# Altium schematic sheet RoboRIOSPIBreakout.SchDoc
size A; SheetNumber: 1; SheetTotal: 1
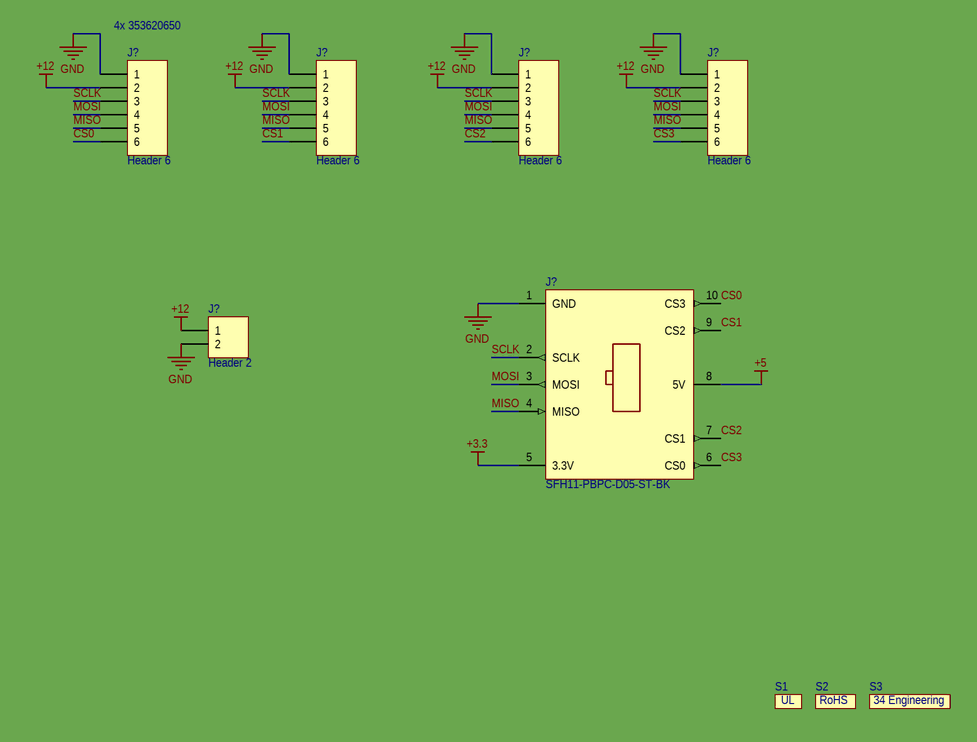
[diagram p0: RoboRIOSPIBreakout.SchDoc]

## Parts
(Parts that share a designator on the sheet are numbered #1, #2 ... from top to bottom, then left to right.)
J?#1  Header 6  [HDR1X6]
J?#2  Header 6  [HDR1X6]
J?#3  Header 6  [HDR1X6]
J?#4  Header 6  [HDR1X6]
J?#5  SFH11-PBPC-D05-ST-BK  [SFH11-PBPC-D05-ST-BK]
J?#6  Header 2  [HDR1X2]
S1  (no value)  [UL]
S2  (no value)  [RoHS]
S3  (no value)  [34EngineeringLogo]

## Nets
+3.3: J?#5.5(3.3V)
+5: J?#5.8(5V)
+12: J?#1.2 J?#2.2 J?#3.2 J?#4.2 J?#6.1
GND: J?#1.1 J?#2.1 J?#3.1 J?#4.1 J?#5.1(GND) J?#6.2
CS0: J?#1.6 J?#5.10(CS3)
CS1: J?#2.6 J?#5.9(CS2)
CS2: J?#3.6 J?#5.7(CS1)
CS3: J?#4.6 J?#5.6(CS0)
MISO: J?#1.5 J?#2.5 J?#3.5 J?#4.5 J?#5.4(MISO)
MOSI: J?#1.4 J?#2.4 J?#3.4 J?#4.4 J?#5.3(MOSI)
SCLK: J?#1.3 J?#2.3 J?#3.3 J?#4.3 J?#5.2(SCLK)

## Notes on the sheet
- (near J?#1) 4x 353620650
- (in symbol 34EngineeringLogo) 34 Engineering

## Library data of the parts
J?#1-J?#4 = Header 6: Header, 6-Pin; LatestRevisionDate: 17-Jul-2002; LatestRevisionNote: Re-released for DXP Platform.; Publisher: Altium Limited
J?#5 = SFH11-PBPC-D05-ST-BK: Female, 10C, Straight .100"CC; No Mt. w/Center Polarizing Key; PBT, Brass, Gold Flash, 105 C; Manufacturer: Sullins; Number of Positions: 10; Connector Type: Header; Pitch: 0.1inch; Supplier 1: Digi-Key; Manufacturer Part Number: SFH11-PBPC-D05-ST-BK; RoHS: Yes; Category: Connectors; Stock 1: 44672; Pricing 1: 1=0.66000, 10=0.55300, 80=0.49700, 440=0.40661, 1000=0.36144, 5000=0.32630 (USD); Mount: Through Hole; Color: Black; Contact Plating: Gold; Package Quantity: 1; Number of Rows: 2; Packaging: Tray; Termination: Solder; Series: SFH11; Contact Type: Female Socket; Row Spacing: 0.1inch; Lead Free: Lead Free; RoHS Compliant: Yes; ComponentLink1URL: https://datasheet.ciiva.com/754/sfh11-pxxc-dxx-st-xx11160-c-754555.pdf?src-supplier=Digi-Key; ComponentLink1Description: https://datasheet.ciiva.com/754/sfh11-pxxc-dxx-st-xx11160-c-754555.pdf?src-supplier=Digi-Key; Supplier Part Number 1: S9194-ND
J?#6 = Header 2: Header, 2-Pin; LatestRevisionDate: 17-Jul-2002; LatestRevisionNote: Re-released for DXP Platform.; Publisher: Altium Limited
S1 = UL
S2 = RoHS
S3 = 34EngineeringLogo: 34 Engineering Silkscreen Logo